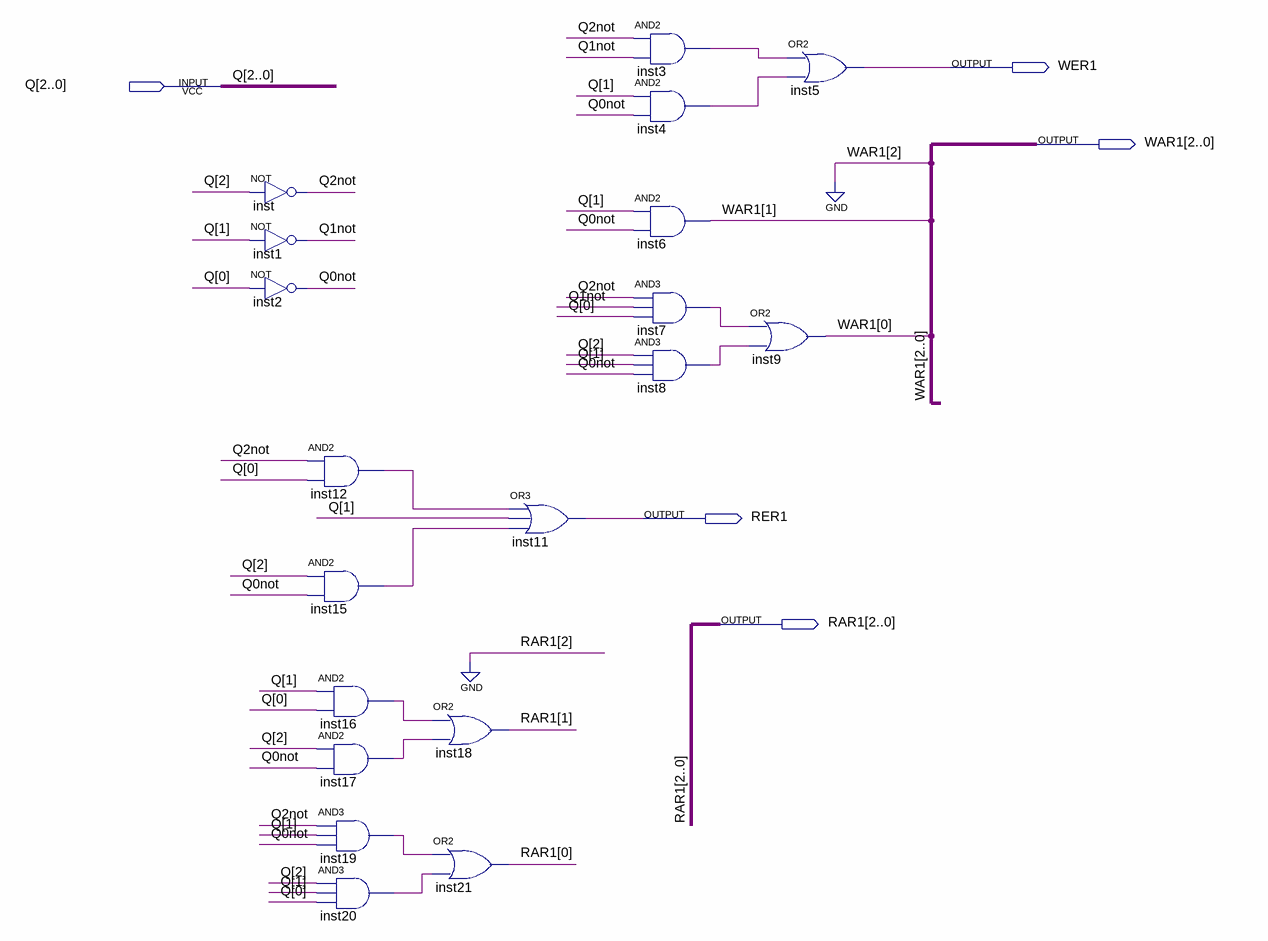
[diagram p0: schematic sheet]
// Quartus schematic R1.bdf as structural Verilog: 19 symbols, 5 pins
module R1 (
  input  [2:0] Q,
  output WER1,
  output [2:0] WAR1,
  output RER1,
  output [2:0] RAR1
);

  wire inst3_out, inst4_out, inst7_out, inst8_out, inst12_out, inst15_out, inst16_out, inst17_out,
       inst19_out, inst20_out, Q0not, Q1not, Q2not;

  not inst (Q2not, Q[2]);
  not inst1 (Q1not, Q[1]);
  not inst2 (Q0not, Q[0]);
  and inst12 (inst12_out, Q2not, Q[0]);
  and inst15 (inst15_out, Q[2], Q0not);
  and inst16 (inst16_out, Q[1], Q[0]);
  and inst17 (inst17_out, Q[2], Q0not);
  and inst19 (inst19_out, Q2not, Q[1], Q0not);
  and inst20 (inst20_out, Q[2], Q[1], Q[0]);
  or inst18 (RAR1[1], inst16_out, inst17_out);
  or inst21 (RAR1[0], inst19_out, inst20_out);
  or inst11 (RER1, inst12_out, Q[1], inst15_out);
  and inst3 (inst3_out, Q2not, Q1not);
  and inst4 (inst4_out, Q[1], Q0not);
  and inst6 (WAR1[1], Q[1], Q0not);
  and inst7 (inst7_out, Q2not, Q1not, Q[0]);
  and inst8 (inst8_out, Q[2], Q[1], Q0not);
  or inst9 (WAR1[0], inst7_out, inst8_out);
  or inst5 (WER1, inst3_out, inst4_out);

  assign RAR1[2] = 1'b0;
  assign WAR1[2] = 1'b0;
endmodule
